# Altium schematic sheet 01_TRANSDUCERS.SchDoc: WULPUS High-voltage MUX PCB
size A3; DrawnBy: Sebastian Frey; Organization: Integrated Systems Laboratory; Revision: v1.1; SheetNumber: 2; SheetTotal: 2
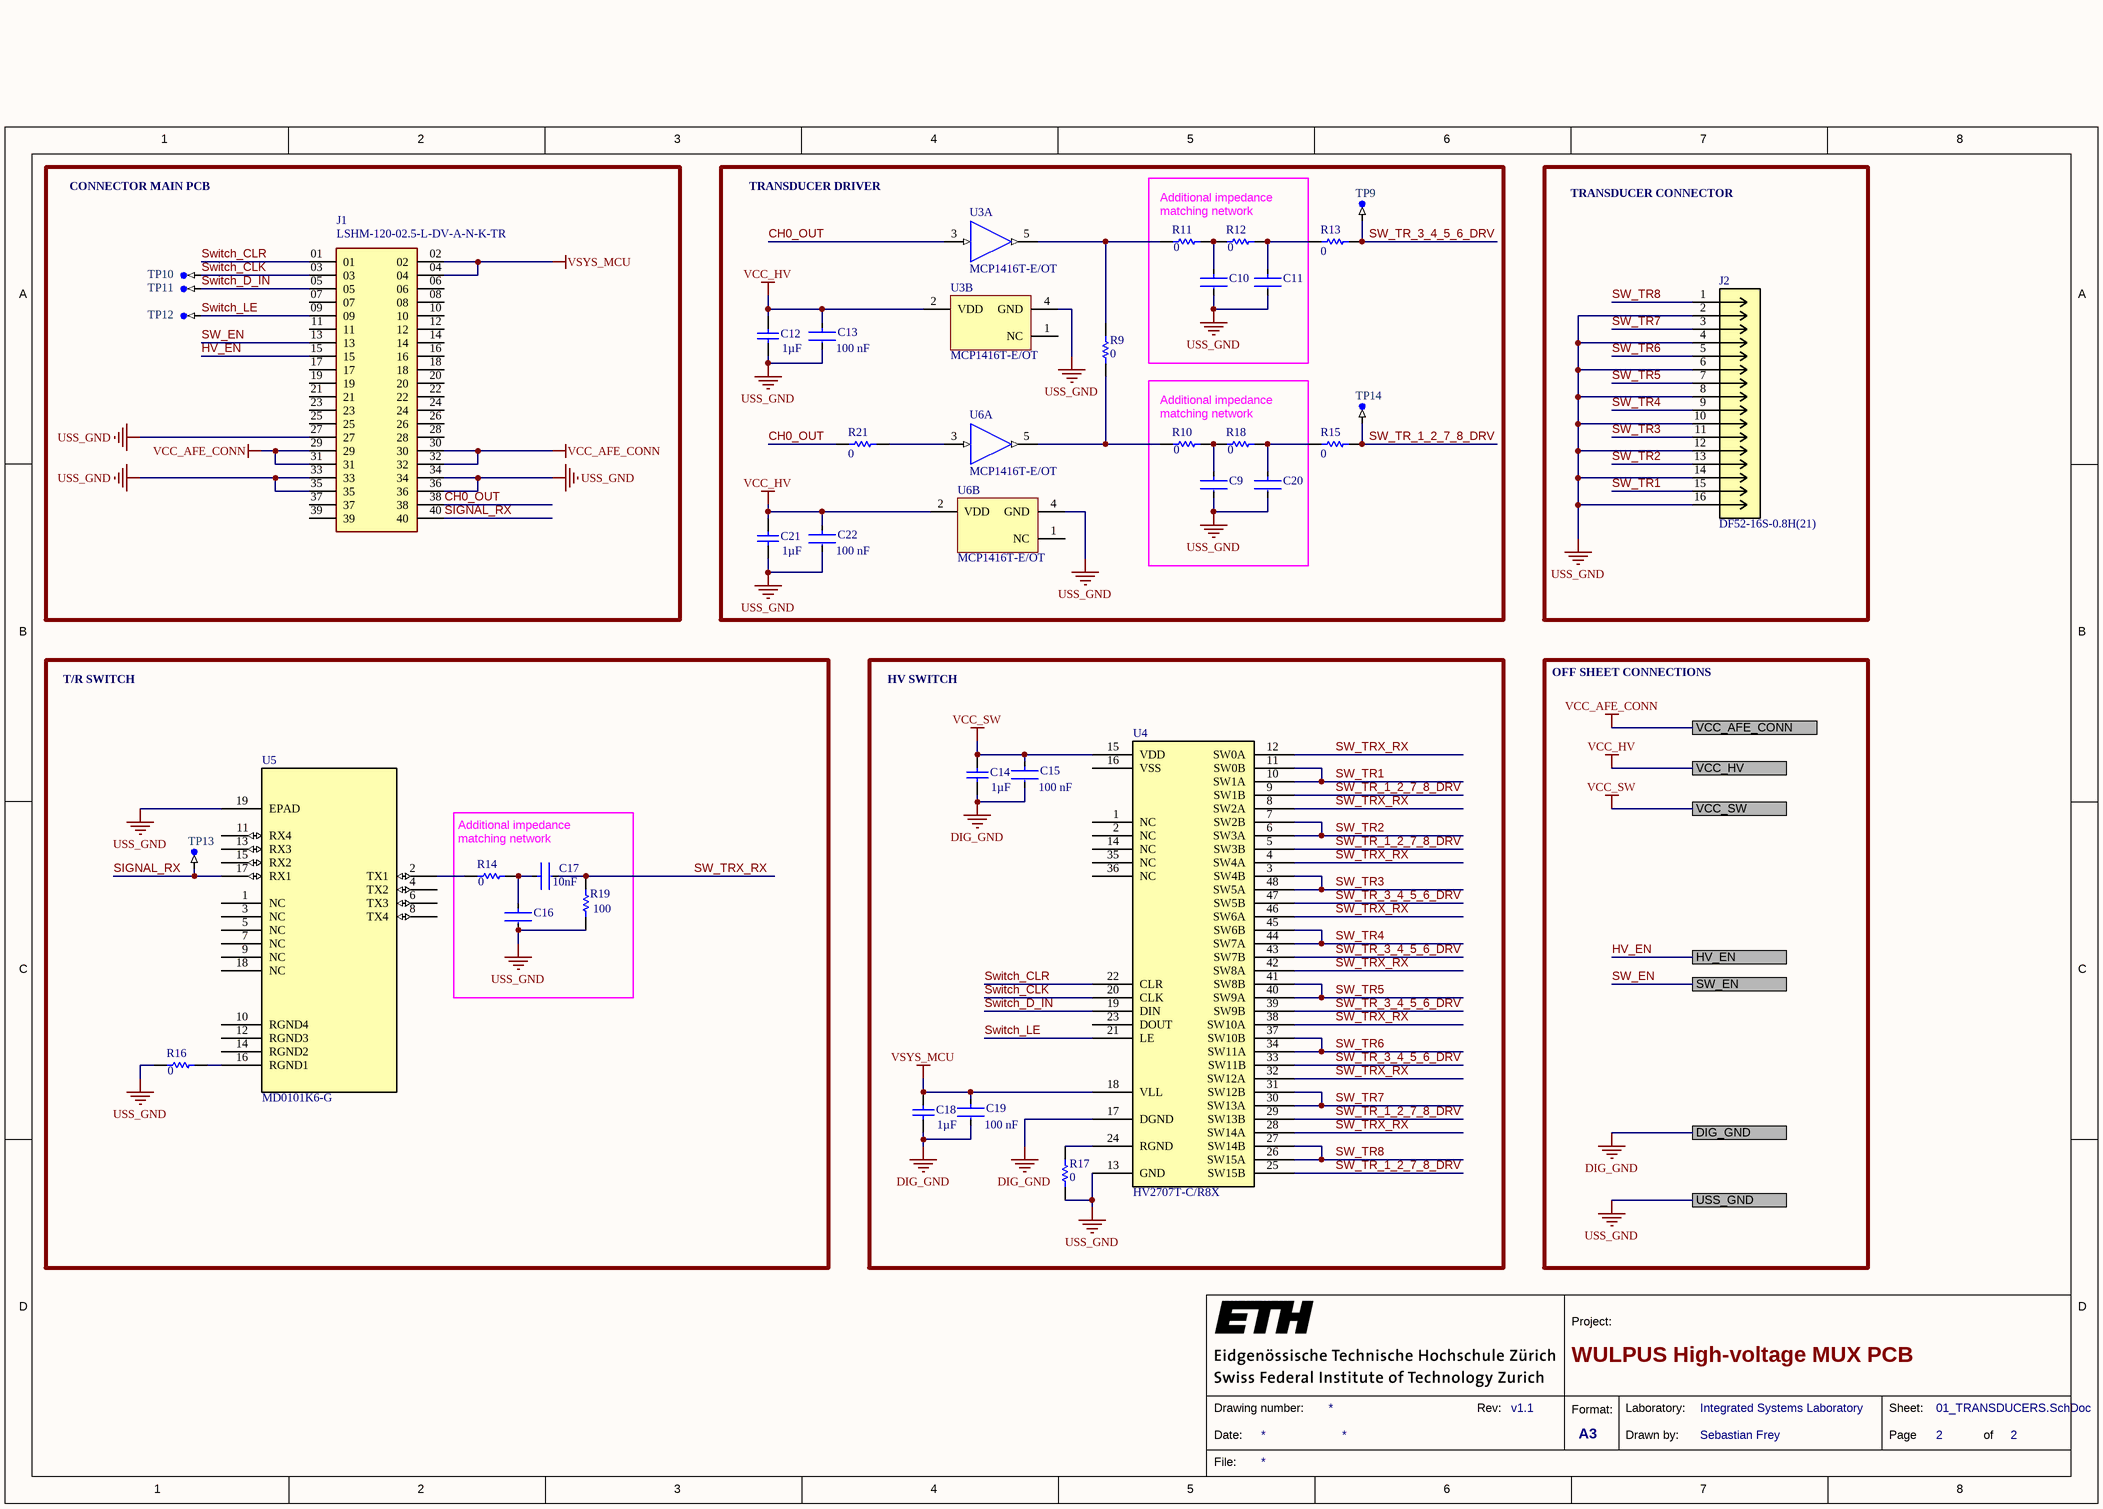
[diagram p0: 01_TRANSDUCERS.SchDoc]

## Parts
C9  CC0603KRX7R9BB104  [FP-CC0603-DA-MFG]  (value not drawn)
C10  CC0603KRX7R9BB104  [FP-CC0603-DA-MFG]  (value not drawn)
C11  CC0603KRX7R9BB104  [FP-CC0603-DA-MFG]  (value not drawn)
C12  Capacitance: 1µF  [CAPC1608X90X20LL10]  (hidden comment: C1608X5R1H105K080AB)
C13  Capacitance: 100 nF  [FP-CC0603-DA-MFG]  (hidden comment: CC0603KRX7R9BB104)
C14  Capacitance: 1µF  [CAPC1608X90X20LL10]  (hidden comment: C1608X5R1H105K080AB)
C15  Capacitance: 100 nF  [FP-CC0603-DA-MFG]  (hidden comment: CC0603KRX7R9BB104)
C16  CC0603KRX7R9BB104  [FP-CC0603-DA-MFG]  (value not drawn)
C17  Capacitance: 10nF  [FP-CL165-IPC_C]  (hidden comment: CL05B103KB5NNNC)
C18  Capacitance: 1µF  [CAPC1608X90X20LL10]  (hidden comment: C1608X5R1H105K080AB)
C19  Capacitance: 100 nF  [FP-CC0603-DA-MFG]  (hidden comment: CC0603KRX7R9BB104)
C20  CC0603KRX7R9BB104  [FP-CC0603-DA-MFG]  (value not drawn)
C21  Capacitance: 1µF  [CAPC1608X90X20LL10]  (hidden comment: C1608X5R1H105K080AB)
C22  Capacitance: 100 nF  [FP-CC0603-DA-MFG]  (hidden comment: CC0603KRX7R9BB104)
J1  LSHM-120-02.5-L-DV-A-N-K-TR  [SAMTEC_LSHM-120-XX.X-X-DV-A-N-XX]
J2  DF52-16S-0.8H(21)  [CONN_DF52-16S-0.8H(21)_HIR]
R9  Resistance: 0  [RESC1005X40X25NL05T10]  (hidden comment: RC0402JR-070RL)
R10  Resistance: 0  [RESC1005X40X25NL05T10]  (hidden comment: RC0402JR-070RL)
R11  Resistance: 0  [RESC1005X40X25NL05T10]  (hidden comment: RC0402JR-070RL)
R12  Resistance: 0  [RESC1005X40X25NL05T10]  (hidden comment: RC0402JR-070RL)
R13  Resistance: 0  [RESC1005X40X25NL05T10]  (hidden comment: RC0402JR-070RL)
R14  Resistance: 0  [RESC1005X40X25NL05T10]  (hidden comment: RC0402JR-070RL)
R15  Resistance: 0  [RESC1005X40X25NL05T10]  (hidden comment: RC0402JR-070RL)
R16  Resistance: 0  [RESC1005X40X25NL05T10]  (hidden comment: RC0402JR-070RL)
R17  Resistance: 0  [RESC1005X40X25NL05T10]  (hidden comment: RC0402JR-070RL)
R18  Resistance: 0  [RESC1005X40X25NL05T10]  (hidden comment: RC0402JR-070RL)
R19  Resistance: 100  [RESC1005X40X25NL05T05]  (hidden comment: ERJ-2GEJ101X)
R21  Resistance: 0  [RESC1005X40X25NL05T10]  (hidden comment: RC0402JR-070RL)
TP9  TP-SM-C-100  [TP-SM-C-100]  (value not drawn)  (no BOM)
TP10  TP-SM-C-100  [TP-SM-C-100]  (value not drawn)  (no BOM)
TP11  TP-SM-C-100  [TP-SM-C-100]  (value not drawn)  (no BOM)
TP12  TP-SM-C-100  [TP-SM-C-100]  (value not drawn)  (no BOM)
TP13  TP-SM-C-100  [TP-SM-C-100]  (value not drawn)  (no BOM)
TP14  TP-SM-C-100  [TP-SM-C-100]  (value not drawn)  (no BOM)
U3  MCP1416T-E/OT  [SOT-23-OT5_M]  (parts A,B of 2)
U4  HV2707T-C/R8X  [LQFP48_7X7MC_MCH]
U5  MD0101K6-G  [DFN18_5X5_MCH]
U6  MCP1416T-E/OT  [SOT-23-OT5_M]  (parts A,B of 2)

## Blocks framed on the sheet
CONNECTOR MAIN PCB: J1 TP10-TP12
TRANSDUCER DRIVER: C9-C13 C20-C22 R9-R13 R15 R18 R21 TP9 TP14 U3 U6
TRANSDUCER CONNECTOR: J2
T/R SWITCH: C16 C17 R14 R16 R19 TP13 U5
HV SWITCH: C14 C15 C18 C19 R17 U4

## Ports
DIG_GND, HV_EN, SW_EN, USS_GND, VCC_AFE_CONN, VCC_HV, VCC_SW

## Nets
DIG_GND: C14.1 C15.2 C18.1 C19.2 U4.17(DGND) ; port DIG_GND
USS_GND: C9.2 C10.2 C11.2 C12.1 C13.2 C16.2 C20.2 C21.1 C22.2 J1.27 J1.33 J1.34 J1.35 J1.36 J2.2 J2.4 J2.6 J2.8 J2.10 J2.12 J2.14 J2.16 R16.2 R17.2 R19.1 U3.4(GND) U4.13(GND) U5.19(EPAD) U6.4(GND) ; port USS_GND
VCC_AFE_CONN: J1.29 J1.30 J1.31 J1.32 ; port VCC_AFE_CONN
VCC_HV: C12.2 C13.1 C21.2 C22.1 U3.2(VDD) U6.2(VDD) ; port VCC_HV
VCC_SW: C14.2 C15.1 U4.15(VDD) ; port VCC_SW
VSYS_MCU: C18.2 C19.1 J1.02 J1.04 U4.18(VLL)
CH0_OUT: J1.38 R21.1 U3.3(IN)
HV_EN: J1.15 ; port HV_EN
SIGNAL_RX: J1.40 TP13.1 U5.17(RX1)
SW_EN: J1.13 ; port SW_EN
SW_TR1: J2.15 U4.10(SW1A) U4.11(SW0B)
SW_TR2: J2.13 U4.6(SW3A) U4.7(SW2B)
SW_TR3: J2.11 U4.3(SW4B) U4.48(SW5A)
SW_TR4: J2.9 U4.44(SW7A) U4.45(SW6B)
SW_TR5: J2.7 U4.40(SW9A) U4.41(SW8B)
SW_TR6: J2.5 U4.34(SW11A) U4.37(SW10B)
SW_TR7: J2.3 U4.30(SW13A) U4.31(SW12B)
SW_TR8: J2.1 U4.26(SW15A) U4.27(SW14B)
SW_TR_1_2_7_8_DRV: R15.2 TP14.1 U4.5(SW3B) U4.9(SW1B) U4.25(SW15B) U4.29(SW13B)
SW_TR_3_4_5_6_DRV: R13.2 TP9.1 U4.33(SW11B) U4.39(SW9B) U4.43(SW7B) U4.47(SW5B)
SW_TRX_RX: C17.2 R19.2 U4.4(SW4A) U4.8(SW2A) U4.12(SW0A) U4.28(SW14A) U4.32(SW12A) U4.38(SW10A) U4.42(SW8A) U4.46(SW6A)
Switch_CLK: J1.03 TP10.1 U4.20(CLK)
Switch_CLR: J1.01 U4.22(CLR)
Switch_D_IN: J1.05 TP11.1 U4.19(DIN)
Switch_LE: J1.09 TP12.1 U4.21(LE)
NetC9_1: C9.1 R10.1 R18.2
NetC10_1: C10.1 R11.1 R12.2
NetC11_1: C11.1 R12.1 R13.1
NetC16_1: C16.1 C17.1 R14.1
NetC20_1: C20.1 R15.1 R18.1
NetR9_1: R9.1 R11.2 U3.5(OUT)
NetR9_2: R9.2 R10.2 U6.5(OUT)
NetR14_2: R14.2 U5.2(TX1)
NetR16_1: R16.1 U5.16(RGND1)
NetR17_1: R17.1 U4.24(RGND)
NetR21_2: R21.2 U6.3(IN)

Not connected (* = marked no-connect by the designer): J1 06 07 08 10 11 12 14 16 17 18 19 20 21 22 23 24 25 26 28 37 39; U3 1(NC); U4 1(NC) 2(NC) 14(NC) 16(VSS) 23(DOUT) 35(NC) 36(NC); U5 1(NC) 3(NC) 4(TX2) 5(NC) 6(TX3) 7(NC) 8(TX4) 9(NC) 10(RGND4) 11(RX4) 12(RGND3) 13(RX3) 14(RGND2) 15(RX2) 18(NC); U6 1(NC)

## Notes on the sheet
- Additional impedance matching network
- OFF SHEET CONNECTIONS
- 1
- 2
- 3
- 4
- 5
- 6
- 7
- 8
- A
- B
- C
- D
- Project:
- Date:
- Drawing number:
- Rev:
- Format:
- A3
- Drawn by:
- Laboratory:
- Page
- Sheet:
- of
- File:

## Library data of the parts
C9-C11 C16 C20 = CMP-2100-03601-2: CAP CER 0.1UF 50V X7R 0603; Manufacturer: YAGEO; Material: Ceramic; Capacitance: 100 nF; Temperature Coefficient: 15%; Tolerance: 0.1; Value: 100 nF; Height: 0.9mm; Voltage: 50 V; ComponentLink2Description: Datasheet; Device Class L2: Capacitors; Temperature Range High: +125°C; Category: Cap; Footprint Url: http://www.yageo.com/exep/pages/download/literatures/UPY-C_GEN_24.pdf; ComponentLink2URL: http://www.yageo.com/documents/recent/UPY-GPHC_X7R_6.3V-to-50V_18.pdf; Package: CC0603-DA; Temperature: -55°C to +125°C; Voltage Rating: 50 V; Temperature Characteristic: X7R; Device Class L1: Passive Components; Temperature Range Low: -55°C; Manufacturer Part Number: CC0603KRX7R9BB104; RoHS: TRUE; Automotive: No; Device Class L3: Ceramic Capacitors; Octopart: https://octopart.com/cc0603krx7r9bb104-yageo-42244635; Mouser Description: Multilayer Ceramic Capacitor, CC Series, 0.1 - F, - 10%, X7R, 50 V, 0603 [1608 Metric]; Lead Free: Yes; Digikey Description: CAP CER 0.1UF 50V X7R 0603
C12 C14 C18 C21 = CMP-2000-06025-1: Chip Capacitor, 1 uF, +/- 10%, 50 V, -55 to 85 degC, 0603 (1608 Metric), RoHS, Tape and Reel; Manufacturer: TDK; PCN Part Number: MLCCPartNumberChange30/Nov/2012; Other Names: 445-7468-6; Online Catalog: CSeries,GeneralPurpose; Product Training Modules: CSeriesGeneralApplicationsSEAT,CCV,andTVCLDesignToolsGuidetoReplacinganElectrolyticCapacitorwithanMLCC; Voltage - Rated: 50V; Design Resources: 20WNon-IsolatedBuckLEDDriverUsingPLLNK460KG; Temperature Coefficient: X5R; Series: C; Datasheet Version: 08/2016; Package Description: 2-Pin Surface Mount Device, Body 1.6 x 0.8 mm; Mounting Technology: SurfaceMount; Features: -; Size / Dimension: 0.063"Lx0.031"W(1.60mmx0.80mm); Lead Spacing: -; Operating Temperature: -55°C~85°C; Tolerance: ±10%; Height - Seated (Max): -; Mounting Type: SurfaceMount,MLCC; Ratings: -; Standard Package: 1; Applications: GeneralPurpose; Datasheet URL: https://product.tdk.com/info/en/catalog/datasheets/mlcc_commercial_general_en.pdf; Category: Capacitors; Lead Style: -; Packaging: Digi-Reel®; RoHS Information: RoHSCertificate-MLCC; Package / Case: 0603(1608Metric); Package Reference: 0603; Manufacturer URL: http://www.tdk.com/; Thickness (Max): 0.035"(0.90mm); Family: CeramicCapacitors
C13 C15 C19 C22 = CMP-2100-03601-2: CAP CER 0.1UF 50V X7R 0603; Manufacturer: YAGEO; Material: Ceramic; Temperature Coefficient: 15%; Tolerance: 0.1; Value: 100 nF; Height: 0.9mm; Voltage: 50 V; ComponentLink2Description: Datasheet; Device Class L2: Capacitors; Temperature Range High: +125°C; Category: Cap; Footprint Url: http://www.yageo.com/exep/pages/download/literatures/UPY-C_GEN_24.pdf; ComponentLink2URL: http://www.yageo.com/documents/recent/UPY-GPHC_X7R_6.3V-to-50V_18.pdf; Package: CC0603-DA; Temperature: -55°C to +125°C; Voltage Rating: 50 V; Temperature Characteristic: X7R; Device Class L1: Passive Components; Temperature Range Low: -55°C; Manufacturer Part Number: CC0603KRX7R9BB104; RoHS: TRUE; Automotive: No; Device Class L3: Ceramic Capacitors; Octopart: https://octopart.com/cc0603krx7r9bb104-yageo-42244635; Mouser Description: Multilayer Ceramic Capacitor, CC Series, 0.1 - F, - 10%, X7R, 50 V, 0603 [1608 Metric]; Lead Free: Yes; Digikey Description: CAP CER 0.1UF 50V X7R 0603
C17 = CMP-13271-000387-1: Cap Ceramic 10nF 50V X7R ±10% SMD 0402 +125°C Paper T/R; Depth: 0.5mm; Length: 1mm; Lead Free: Lead Free; Case Code (Metric): 1005; Width: 0.02inch; Min Operating Temperature: -55°C; Thickness: 0.022inch; Package Quantity: 1; Mount: Surface Mount; Height: 0.5mm; Voltage: 50V; Material: Ceramic; Tolerance: 10%; Case Code (Imperial): 0402; Radiation Hardening: No; Case/Package: 0402; Max Operating Temperature: 125°C; Voltage Rating (DC): 50V; Contact Plating: Tin; Packaging: Tape and Reel; Voltage Rating: 50V; Dielectric: X7R
J1 = LSHM-120-02.5-L-DV-A-N-K-TR: Conn Socket and Terminal Strip HDR/SKT 40 POS 0.5mm Solder ST SMD T/R; Manufacturer: Samtec; Number of Contacts: 40; Supplier 1: Digi-Key; RoHS: Yes; Category: Connectors; Stock 1: 3008; Pricing 1: 1=6.60000, 10=5.97000, 25=5.63960, 50=5.50200, 100=5.22690, 250=4.67672 (USD); Contact Plating: Gold; Contact Material: Bronze; Housing Color: Black; Housing Material: Polymer; Min Operating Temperature: -55°C; Max Operating Temperature: 125°C; Number of Rows: 2; Termination: Solder; Packaging: Tape and Reel; Orientation: Straight; Series: LSH; Length: 14.7mm; Pitch: 0.5mm; Depth: 4.98mm; Radiation Hardening: No; REACH SVHC: No SVHC; RoHS Compliant: Yes; ComponentLink1URL: http://www.farnell.com/datasheets/2372721.pdf?src-supplier=Farnell; ComponentLink1Description: http://www.farnell.com/datasheets/2372721.pdf?src-supplier=Farnell; ComponentLink2URL: http://www.farnell.com/datasheets/2000266.pdf?src-supplier=Farnell; ComponentLink2Description: http://www.farnell.com/datasheets/2000266.pdf?src-supplier=Farnell; ComponentLink3URL: http://components.arrow.com/part/dataview/0323_01943898?src-supplier=Arrow+Europe; ComponentLink3Description: http://components.arrow.com/part/dataview/0323_01943898?src-supplier=Arrow+Europe; ComponentLink4URL: http://components.arrow.com/part/dataview/48680868S8397842N1004?src-supplier=Arrow+Electronics; ComponentLink4Description: http://components.arrow.com/part/dataview/48680868S8397842N1004?src-supplier=Arrow+Electronics; ComponentLink5URL: http://www.farnell.com/datasheets/2000266.pdf?src-supplier=Element14; ComponentLink5Description: http://www.farnell.com/datasheets/2000266.pdf?src-supplier=Element14; ComponentLink6URL: http://suddendocs.samtec.com/prints/lshm-1xx-xx.x-xx-dv-a-x-x-tr-mkt.pdf?src-supplier=Digi-Key; ComponentLink6Description: http://suddendocs.samtec.com/prints/lshm-1xx-xx.x-xx-dv-a-x-x-tr-mkt.pdf?src-supplier=Digi-Key; ComponentLink7URL: ftp://ftp.samtec.com/webfiles/PDF/LSHM.PDF?src-supplier=Avnet; ComponentLink7Description: ftp://ftp.samtec.com/webfiles/PDF/LSHM.PDF?src-supplier=Avnet; ComponentLink8URL: ftp://ftp.samtec.com/webfiles/PDF/LSHM.PDF?src-supplier=Avnet+Europe; ComponentLink8Description: ftp://ftp.samtec.com/webfiles/PDF/LSHM.PDF?src-supplier=Avnet+Europe; ComponentLink9URL: http://www.farnell.com/datasheets/2372721.pdf?src-supplier=Newark; ComponentLink9Description: http://www.farnell.com/datasheets/2372721.pdf?src-supplier=Newark; Supplier Part Number 1: SAM13196CT-ND; Manufacturer Part Number: LSHM-120-02.5-L-DV-A-N-K-TR
J2 = DF52-16S-0.8H(21): No Description Available; Mfr_Name: Hirose; Copyright: Copyright (C) 2022 Ultra Librarian. All rights reserved.; Manufacturer_Part_Number: DF52-16S-0.8H(21); RefDes: RefDes; Type: DEV
R9-R18 R21 = CMP-1011-00001-2: Manufacturer: Yageo / Phycomp; Part Number: RC0402JR-070RL
R19 = CMP-2002-00431-1: Manufacturer: Panasonic; Part Number: ERJ-2GEJ101X
TP9-TP14 = CMP-0484-00002-1: Test Point, Surface Mount, Circular, Pad Diameter 1 mm
U3 U6 = CMP-0137-00410-1: Tiny 1.5A, High-Speed Power MOSFET Driver, Non Inverting, Extended Temperature, Tape and Reel; PackageDescription: 5-Lead Plastic Small Outline Transistor (OT) [SOT-23]; Code_IPC: SOT23-5; PackageVersion: revBB, Aug-2009; PackageReference: SOT-23-OT5; DatasheetVersion: revC, Dec-2008
U4 = HV2707T-C/R8X: 16-CH 200V No Hv Bias Switch (SPST), 2 Bleed Resistor 48 LQFP 7X7X1.4MM T/r Rohs Compliant: Yes; Manufacturer: Microchip; Supplier 1: Digi-Key; RoHS: Yes; Category: Decoders and Multiplexers; Stock 1: 440; Pricing 1: 1=19.01000, 25=15.84720, 100=14.65500 (USD); Manufacturer Part Number: HV2707T-C/R8X
U5 = MD0101K6-G: No Description Available; Mfr_Name: Microchip; Copyright: Copyright (C) 2022 Ultra Librarian. All rights reserved.; Manufacturer_Part_Number: MD0101K6-G; RefDes: RefDes; Type: DEV